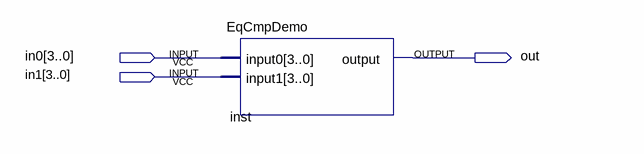
[diagram p0: schematic sheet]
// Quartus schematic EqCmp_wBlock.bdf as structural Verilog: 1 symbols, 3 pins
module EqCmp_wBlock (
  input  [3:0] in0,
  input  [3:0] in1,
  output out
);

  EqCmpDemo inst (.input0(in0), .input1(in1), .\output (out));
endmodule
